# Altium schematic sheet AnalogSignalConditioning.SchDoc
size A4; CompanyName: Technische Hochschule Nürnberg Georg Simon Ohm; Organization: UltraZohm; Address1: Kesslerplatz 12; Address2: 90489 Nürnberg; Address3: GERMANY; DocumentNumber: 2; SheetNumber: 2; SheetTotal: 2; Website: www.ultrazohm.com
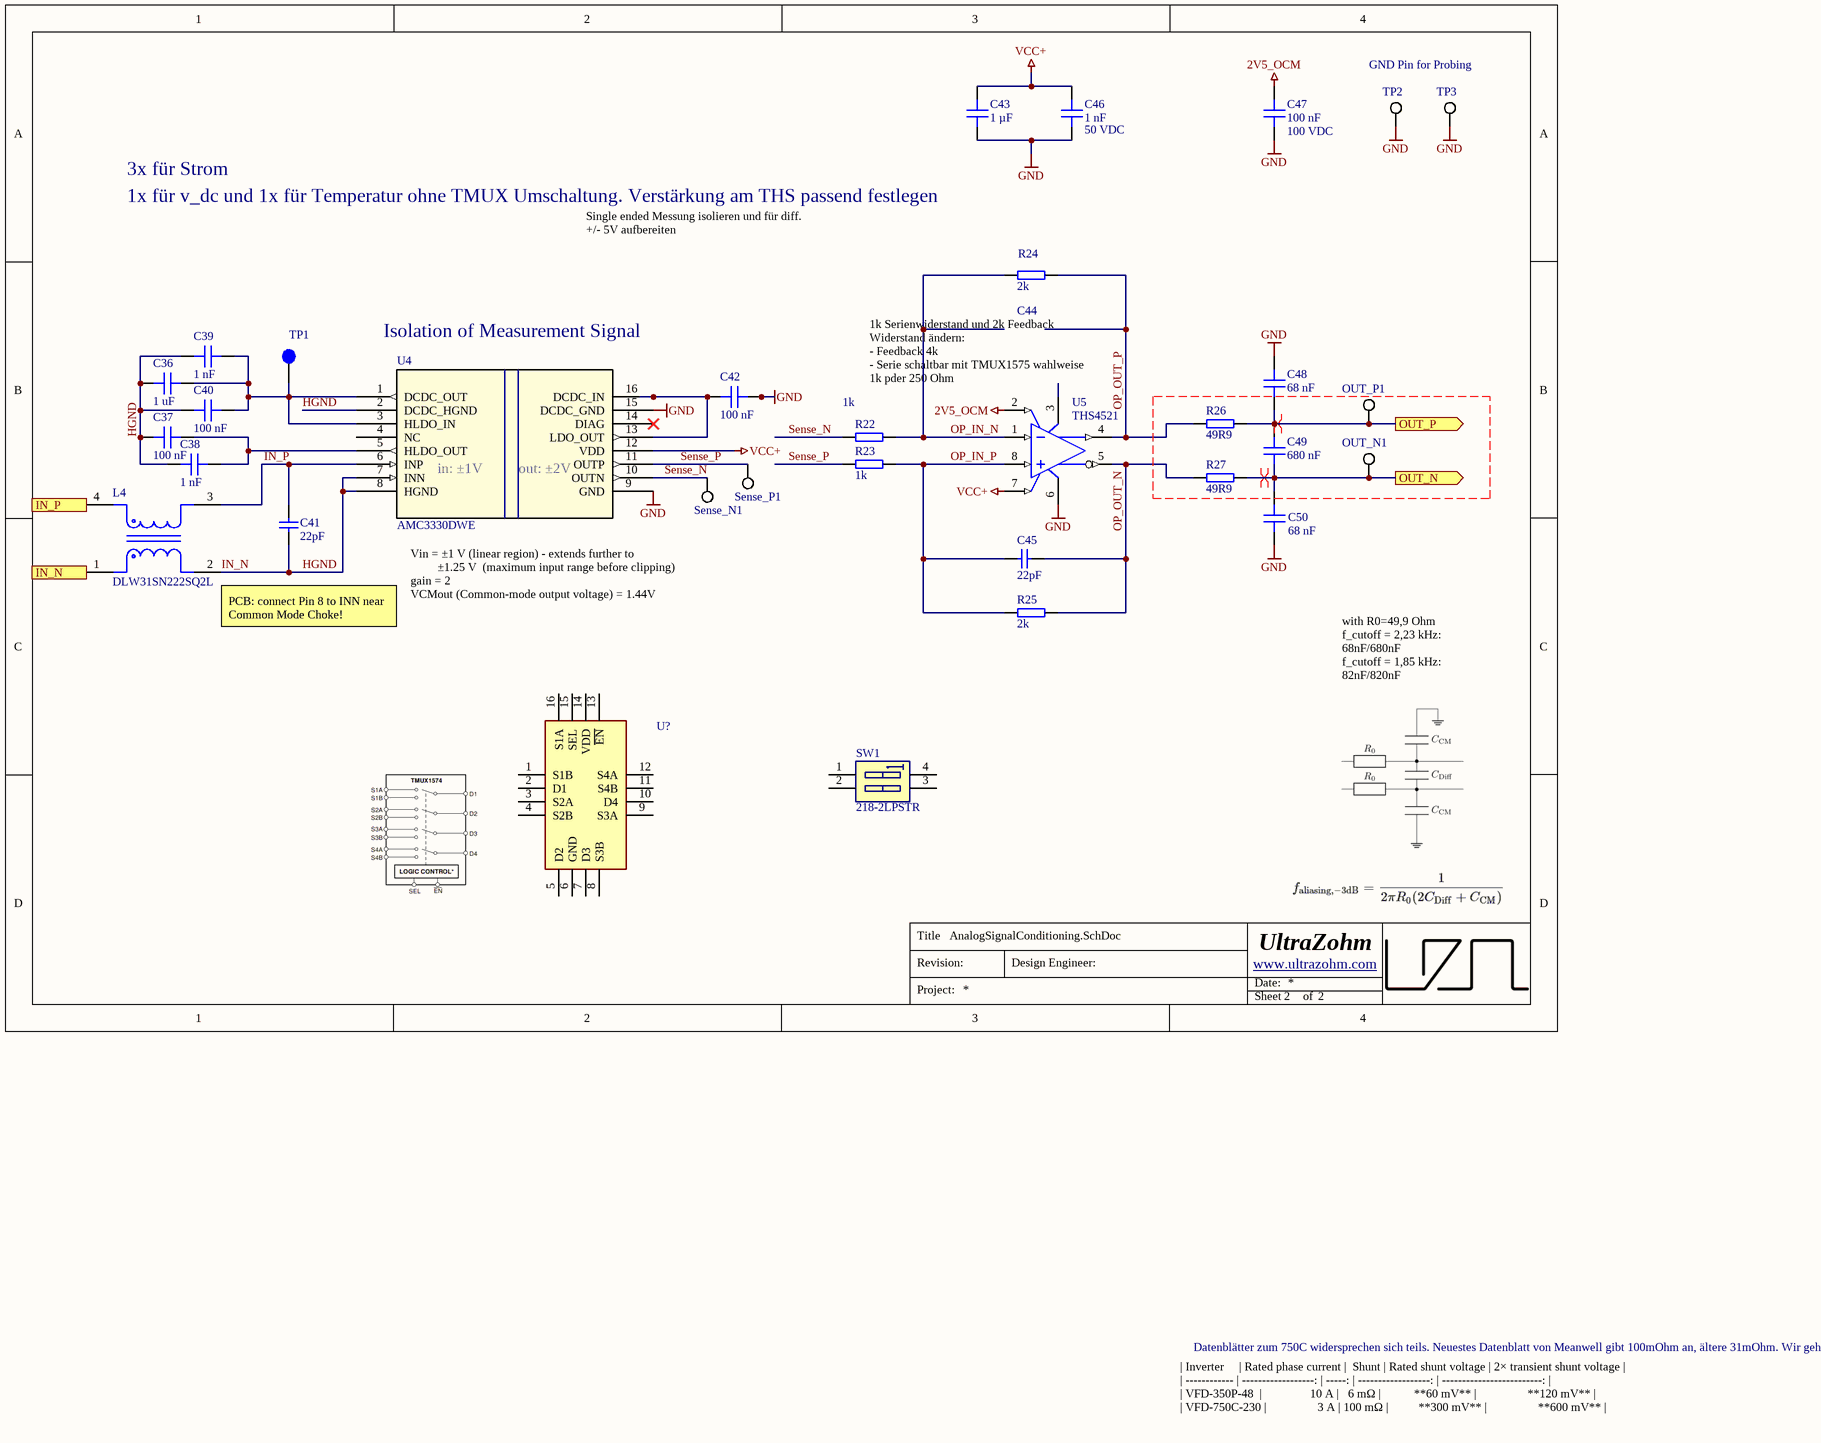
[diagram p0: AnalogSignalConditioning.SchDoc]

## Parts
C36  1 uF  [C_0603]
C37  100 nF  [C_0603]
C38  1 nF  [C_0603_TE]
C39  1 nF  [C_0603_TE]
C40  100 nF  [C_0603]
C41  22pF  [C_0603_TE]
C42  100 nF  [C_0603]
C43  1 µF  [C_0603]
C44  22pF  [C_0603_TE]
C45  22pF  [C_0603_TE]
C46  1 nF  Voltage Rating: 50 VDC  [C_1206_TE]
C47  100 nF  Voltage Rating: 100 VDC  [C_0603]
C48  68 nF  [C_0603_TE]
C49  680 nF  [C_0805_TE]
C50  68 nF  [C_0603_TE]
L4  DLW31SN222SQ2L  [FP-DLW31S-MFG]
OUT_N1  5015  [KSTN-5019_V]  (value not drawn)
OUT_P1  5015  [KSTN-5019_V]  (value not drawn)
R22  1k  [RES 0603_1608]
R23  1k  [RES 0603_1608]
R24  2k  [RES 0603_1608]
R25  2k  [RES 0603_1608]
R26  49R9  [RES 0603_1608]
R27  49R9  [RES 0603_1608]
Sense_N1  5015  [KSTN-5019_V]  (value not drawn)
Sense_P1  5015  [KSTN-5019_V]  (value not drawn)
SW1  218-2LPSTR  [2182LPSTR]
TP1  Testpoint 1mm  [TP_1mm]  (value not drawn)  (no BOM)
TP2  5015  [KSTN-5019_V]  (value not drawn)
TP3  5015  [KSTN-5019_V]  (value not drawn)
U4  AMC3330DWE  [SOIC_30DWER_TEX]
U5  THS4521  [ADA4940-1ARZ-R7]
U?  TMUX1574RSVR  [QFN40P180X260X55-16N]  (value not drawn)

## Ports
IN_N (in), IN_P (in), OUT_N (out), OUT_P (out)

## Nets
2V5_OCM: C47.1 U5.2(VOCM)
GND: C42.2 C43.1 C46.1 C47.2 C48.1 C50.2 TP2.1 TP3.1 U4.9(GND) U4.15(DCDC_GND) U5.6(VS-)
VCC+: C43.2 C46.2 U4.12(VDD) U5.3(VS+) U5.7(~{PD})
HGND: C36.1 C37.1 C38.1 C39.1 C40.1 C41.2 L4.2 U4.2(DCDC_HGND) U4.7(INN) U4.8(HGND)  [also labelled IN_N]
IN_N: L4.1 ; port IN_N
IN_P: C41.1 L4.3 U4.6(INP)
IN_P: L4.4 ; port IN_P  [a separate net that carries the same name]
OP_IN_N: C44.2 R22.2 R24.1 U5.1(VIN-)
OP_IN_P: C45.2 R23.2 R25.1 U5.8(VIN+)
OP_OUT_N: C45.1 R25.2 R27.1 U5.5(VOUT-)
OP_OUT_P: C44.1 R24.2 R26.1 U5.4(VOUT+)
OUT_N: C49.1 C50.1 OUT_N1.1 R27.2 ; port OUT_N
OUT_P: C48.2 C49.2 OUT_P1.1 R26.2 ; port OUT_P
Sense_N: R22.1 Sense_N1.1 U4.10(OUTN)
Sense_P: R23.1 Sense_P1.1 U4.11(OUTP)
NetC36_2: C36.2 C39.2 C40.2 TP1.1 U4.1(DCDC_OUT) U4.3(HLDO_IN)
NetC37_2: C37.2 C38.2 U4.5(HLDO_OUT)
NetC42_1: C42.1 U4.13(LDO_OUT) U4.16(DCDC_IN)

Not connected (* = marked no-connect by the designer): SW1 1 2 3 4; U4 4(NC) 14(DIAG)*; U? 1(S1B) 2(D1) 3(S2A) 4(S2B) 5(D2) 6(GND) 7(D3) 8(S3B) 9(S3A) 10(D4) 11(S4B) 12(S4A) 13(~{EN}) 14(VDD) 15(SEL) 16(S1A)

## Layout directives
differential pair: OUT_N, OUT_P

## Notes on the sheet
- GND Pin for Probing
- 3x für Strom
- 1x für v_dc und 1x für Temperatur ohne TMUX Umschaltung. Verstärkung am THS passend festlegen
- Single ended Messung isolieren und für diff. +/- 5V aufbereiten
- Isolation of Measurement Signal
- (near C44) 1k Serienwiderstand und 2k Feedback Widerstand ändern:
  - Feedback 4k
  - Serie schaltbar mit TMUX1575 wahlweise 1k pder 250 Ohm
- (near U4) in: ±1V
- (near U4) out: ±2V
- (near L4) PCB: connect Pin 8 to INN near Common Mode Choke!
- Vin = ±1 V (linear region) - extends further to
  ±1.25 V  (maximum input range before clipping)
  gain = 2
  VCMout (Common-mode output voltage) = 1.44V
- with R0=49,9 Ohm
  f_cutoff = 2,23 kHz: 68nF/680nF
  f_cutoff = 1,85 kHz: 82nF/820nF
- Datenblätter zum 750C widersprechen sich teils. Neuestes Datenblatt von Meanwell gibt 100mOhm an, ältere 31mOhm. Wir gehen von 100 aus
- | Inverter     | Rated phase current |  Shunt | Rated shunt voltage | 2× transient shunt voltage |
  | ------------ | ------------------: | -----: | ------------------: | -------------------------: |
  | VFD-350P-48  |                10 A |   6 mΩ |           **60 mV** |                 **120 mV** |
  | VFD-750C-230 |                 3 A | 100 mΩ |          **300 mV** |                 **600 mV** |
- Title
- Revision:
- Design Engineer:
- Date:
- Project:
- Sheet
- of

## Library data of the parts
C36 = CC0603KRX5R9BB105: 1uF 50V X5R ±10% 0603 Multilayer Ceramic Capacitors MLCC - SMD/SMT ROHS; Manufacturer: YAGEO; Voltage Rating: 50 VDC; Created from: NDiringer; Manufacturer Part Number: CC0603KRX5R9BB105; PartID: 508; Created On: 25.08.2025 09:26:51; ComponentLink1Description: Datasheet; ComponentLink1URL: https://jlcpcb.com/partdetail/YAGEO-CC0603KRX5R9BB105/C128624; Component Type: Capacitor 0603; Device Package: 0603; Last Updated: 25.08.2025 09:28:02; Mounting Type: SMD; Operating Temperature: -55 to +125°C; Series: X7R; Supplier 1: JLCPCB; Supplier Part Number 1: C128624; Supplier 2: LCSC; Supplier Part Number 2: C15849; Type: Capacitor; Tolerance: 10 %; Value: 1 uF; Live Cycle Status: 1; LCSC Part Number: C15849; Stock number: not stored
C37 C40 C42 = CC0603KRX7R9BB104: Capacitor 0603, 50 VDC, 100 nF, X7R; Manufacturer: YAGEO; Tolerance: 10 %; Created from: AGeiger; Voltage Rating: 50 VDC; Manufacturer Part Number: CC0603KRX7R9BB104; PartID: 102; Created On: 22.08.2022 14:35:53; Value: 100 nF; Device Package: 0603; Mounting Type: SMD; Last Updated: 22.08.2022 14:35:53; ComponentLink1Description: Datasheet; ComponentLink1URL: https://datasheet.lcsc.com/lcsc/1809301912_YAGEO-CC0603KRX7R9BB104_C14663.pdf; Component Type: Capacitor 0603; Operating Temperature: -55 - 125°C; Series: X7R; Supplier 1: LCSC; Supplier Part Number 1: C14663; Supplier 2: Mouser; Supplier Part Number 2: 603-CC603KRX7R9BB104; Type: Capacitor; Live Cycle Status: 1; LCSC Part Number: C14663
C38 C39 = CC0603KRX7R9BB102: 1nF 50V X7R ±10% 0603 Multilayer Ceramic Capacitors MLCC - SMD/SMT ROHS; Manufacturer: YAGEO; Created from: NDiringer; Voltage Rating: 50 VDC; Manufacturer Part Number: CC0603KRX7R9BB102; PartID: 507; Created On: 25.08.2025 09:10:16; Value: 1 nF; Device Package: 0603; Tolerance: 10 %; Mounting Type: SMD; Last Updated: 25.08.2025 09:34:56; ComponentLink1Description: Datasheet; ComponentLink1URL: https://jlcpcb.com/partdetail/YAGEO-CC0603KRX7R9BB102/C100040; Component Type: Capacitor 0603; Operating Temperature: -55 to +125°C; Series: X7R; Supplier 1: JLCPCB; Supplier Part Number 1: C100040; Supplier 2: LCSC; Supplier Part Number 2: C100040; Type: Capacitor; Live Cycle Status: 1; LCSC Part Number: C100040; Stock number: not stored
C41 C44 C45 = CL10C220JB8NNNC: 50V 22pF C0G ±5% 0603 Multilayer Ceramic Capacitors MLCC - SMD/SMT ROHS; Manufacturer: Samsung Electro-Mechanics; Created from: Kilhan; Manufacturer Part Number: CL10C220JB8NNNC; ComponentLink1Description: Datasheet; ComponentLink1URL: https://jlcpcb.com/api/file/downloadByFileSystemAccessId/8579707043277824000; Series: C0G; Supplier 1: LCSC; Supplier Part Number 1: C1653; Tolerance: 5%; Voltage Rating: 50V; PartID: 172; Created On: 22.06.2025 13:02:55; Component Type: Capacitor 0603; Device Package: 0603; Last Updated: 22.06.2025 13:02:55; Mounting Type: SMD; Operating Temperature: –55 to 125°C; Type: Capacitor; Value: 22pF; Live Cycle Status: 1; Stock number: not stored; LCSC Part Number: C1653
C43 = CL10A105KB8NNNC: 50V 1uF X5R ±10% 0603  Multilayer Ceramic Capacitors MLCC - SMD/SMT ROHS; Manufacturer: Samsung Electro-Mechanics; Voltage Rating: 50 VDC; Created from: MGremer; Manufacturer Part Number: CL10A105KB8NNNC; PartID: 5; Created On: 20.12.2020 13:54:13; ComponentLink1Description: Datasheet; ComponentLink1URL: https://datasheet.lcsc.com/lcsc/1810261812_Samsung-Electro-Mechanics-CL10A105KB8NNNC_C15849.pdf; Component Type: Capacitor 0603; Device Package: 0603; Last Updated: 28.11.2022 17:23:01; Mounting Type: SMD; Operating Temperature: -55 - 85°C; Series: M; Supplier 1: LCSC; Supplier Part Number 1: C15849; Type: Capacitor; Tolerance: 10 %; Value: 1 µF; Live Cycle Status: 1; Stock number: Labor SMD Container; LCSC Part Number: C15849
C46 = CC1206KRX7R9BB102: 1nF 50V X7R ±10% 1206 Multilayer Ceramic Capacitors MLCC - SMD/SMT ROHS; Manufacturer: YAGEO; Created from: NDiringer; Manufacturer Part Number: CC1206KRX7R9BB102; PartID: 505; Created On: 25.08.2025 08:45:14; ComponentLink1Description: Datasheet; ComponentLink1URL: https://jlcpcb.com/partdetail/YAGEO-CC1206KRX7R9BB102/C107207; Component Type: Capacitor 1206; Device Package: 1206; Last Updated: 25.08.2025 08:45:14; Mounting Type: SMD; Operating Temperature: -55 to +125°C; Series: X7R; Supplier 1: JLCPCB; Supplier Part Number 1: C107207; Type: Capacitor; Tolerance: 10 %; Value: 1 nF; Live Cycle Status: 1; Stock number: not stored; Supplier 2: LCSC; Supplier Part Number 2: C107207; LCSC Part Number: C107207
C47 = C1608X7S2A104KT000N: 100V 100nF X7S ±10% 0603 Multilayer Ceramic Capacitors MLCC - SMD/SMT ROHS; Manufacturer: TDK; Created from: AGeiger; Manufacturer Part Number: C1608X7S2A104KT000N; PartID: 148; Created On: 20.12.2020 13:54:13; ComponentLink1Description: Datasheet; ComponentLink1URL: https://datasheet.lcsc.com/lcsc/2304140030_TDK-C1608X7S2A104KT000N_C343025.pdf; Component Type: Capacitor 0603; Device Package: 0603; Last Updated: 14.12.2022 12:14:21; Mounting Type: SMD; Operating Temperature: -55 to 125°C; Series: X7R; Supplier 1: LCSC; Supplier Part Number 1: C343025; Type: Capacitor; Tolerance: 10 %; Value: 100 nF; Live Cycle Status: 1; LCSC Part Number: C343025; Stock number: not stored
C48 C50 = CC0603JRX7R9BB683: 50V 68nF X7R ±5% 0603 Multilayer Ceramic Capacitors MLCC - SMD/SMT ROHS; Manufacturer: YAGEO; Voltage Rating: 50 VDC; Created from: NDiringer; Manufacturer Part Number: CC0603JRX7R9BB683; ComponentLink1Description: Datasheet; ComponentLink1URL: https://jlcpcb.com/partdetail/YAGEO-CC0603JRX7R9BB683/C309475; Series: X7R; Supplier 1: JLCPCB; Supplier Part Number 1: C309475; Tolerance: 5 %; PartID: 503; Created On: 14.08.2025 15:37:55; Component Type: Capacitor 0603; Last Updated: 25.08.2025 09:35:07; Mounting Type: SMD; Operating Temperature: -55 to +125°C; Type: Capacitor; Value: 68 nF; Live Cycle Status: 1; Stock number: not stored; LCSC Part Number: C309475; Device Package: 0603
C49 = CC0805KKX7R9BB684: 50V 680nF X7R ±10% 0805 Multilayer Ceramic Capacitors MLCC - SMD/SMT ROHS; Manufacturer: YAGEO; Voltage Rating: 50 VDC; Created from: NDiringer; Manufacturer Part Number: CC0805KKX7R9BB684; ComponentLink1Description: Datasheet; ComponentLink1URL: https://jlcpcb.com/partdetail/YAGEO-CC0805KKX7R9BB684/C107133; Series: X7R; Supplier 1: JLCPCB; Supplier Part Number 1: C107133; Tolerance: 10 %; PartID: 504; Created On: 14.08.2025 15:43:13; Component Type: Capacitor 0805; Device Package: 0805; Last Updated: 14.08.2025 15:43:13; Mounting Type: SMD; Operating Temperature: -55 to +125°C; Type: Capacitor; Value: 680 nF; Live Cycle Status: 1; Stock number: not stored; LCSC Part Number: C107133
L4 = CMP-06045-000034-1: CMC 200MA 2LN 2.2 KOHM SMD; Number of Lines: 2; Voltage Rating: 50V; Voltage Rating (DC): 125V; DC Resistance (DCR): 1.2R; Impedance: 2.2kR; Shielding: Unshielded; Tolerance: 25%; Insulation Resistance: 10MR; Test Frequency: 100MHz; Depth: 1.8mm; DC Current: 200mA; Case/Package: 1206; Number of Pins: 4; Current Rating: 200mA; Weight: 0.001376oz; Current: 200mA; Packaging: Tape and Reel; Termination: SMD/SMT; Height: 1.9mm; Length: 3.2mm; Military Standard: Not; Package Quantity: 1; Mount: Surface Mount; Max Operating Temperature: 85°C; Max DC Current: 200mA; Radiation Hardening: No; Resistor Type: Wirewound; Lead Free: Lead Free; Case Code (Imperial): 1206; Width: 0.063inch; Min Operating Temperature: -40°C; Self Resonant Frequency: 100MHz; REACH SVHC: No SVHC
OUT_N1 OUT_P1 Sense_N1 Sense_P1 TP2 TP3 = 5015: Circuit Board Hardware - PCB SM TEST POINT ON T&R - MINIATURE; Manufacturer: Keystone Electronics; Value: SMD Testpoint; Created from: AGeiger; Supplier Part Number 1: 534-5015; LCSC Part Number: C5199798; Manufacturer Part Number: 5015; PartID: 26; Created On: 03.06.2023 11:19:55; ComponentLink1Description: Datasheet; ComponentLink1URL: https://www.mouser.de/datasheet/2/215/015-744075.pdf; Component Type: Circuit Board Hardware; Device Package: SMD; Last Updated: 03.06.2023 11:43:17; Mounting Type: SMD; Supplier 1: Mouser; Type: PCB SMD Testpoint; Live Cycle Status: 1; ComponentLink2URL: http://www.keyelco.com/product-pdf.cfm?p=1357; ComponentLink2Description: Datasheet
R22 R23 = AR03BTCX1001: 100mW ±0.1% ±25ppm/℃ 1kΩ 0603 Chip Resistor - Surface Mount ROHS; Manufacturer: Viking Tech; Created from: AGeiger; Manufacturer Part Number: AR03BTCX1001; PartID: 240; Created On: 03.09.2022 10:12:43; ComponentLink1Description: Datasheet; ComponentLink1URL: https://datasheet.lcsc.com/lcsc/2011191435_Viking-Tech-AR03BTCX1001_C304069.pdf; Component Type: SMD resistor; Device Package: 0603; Last Updated: 03.09.2022 10:12:43; Mounting Type: SMD; Supplier 1: LCSC; Supplier Part Number 1: C304069; Type: Resistor; Value: 1k; Live Cycle Status: 1; LCSC Part Number: C304069; Tolerance: 0.1%
R24 R25 = ERJ-PB3B2001V: SMD resistor 0.1%; Manufacturer: Panasonic; Created from: DHufnagel; Manufacturer Part Number: ERJ-PB3B2001V; PartID: 215; Created On: 14.12.2020 16:17:14; ComponentLink1Description: Datasheet; ComponentLink1URL: https://www.mouser.de/datasheet/2/315/AOA0000C328-1530132.pdf; Component Type: SMD resistor; Device Package: 0603; Last Updated: 02.03.2021 14:07:32; Mounting Type: SMD; Supplier 1: Mouser; Supplier Part Number 1: 667-ERJ-PB3B2001V; Type: Resistor; Value: 2k; Live Cycle Status: 1; Stock number: not stored; LCSC Part Number: C728588; Tolerance: 0.1%; Supplier 2: LCSC; Supplier Part Number 2: C728588
R26 R27 = RC0603FR-0749R9L: 100mW Thick Film Resistors ±100ppm/℃ ±1% 49.9Ω 0603 Chip Resistor - Surface Mount ROHS; Manufacturer: YAGEO; Created from: AGeiger; Manufacturer Part Number: RC0603FR-0749R9L; PartID: 277; Created On: 14.06.2023 17:42:26; ComponentLink1Description: Datasheet; ComponentLink1URL: https://datasheet.lcsc.com/lcsc/2304140030_YAGEO-RC0603FR-0749R9L_C114625.pdf; Component Type: SMD resistor; Device Package: 0603; Last Updated: 14.06.2023 17:42:26; Mounting Type: SMD; Supplier 1: LCSC; Supplier Part Number 1: C114625; Type: Resistor; Tolerance: 1%; Value: 49R9; Live Cycle Status: 1; LCSC Part Number: C114625
SW1 = 218-2LPSTR: DIP Switches/SIP Switches SPST 2 switch sections; Manufacturer: CTS Electronic Components; Created from: AGeiger; Manufacturer Part Number: 218-2LPSTR; PartID: 44; Created On: 23.08.2024 11:42:29; ComponentLink1Description: Datasheet; ComponentLink1URL: https://www.mouser.de/datasheet/2/96/CTS_Switches_DIP_218_Series_Datasheet-1144897.pdf; Component Type: DIP Switch; Device Package: SMD-4P,3.7x5.8mm; Last Updated: 23.08.2024 11:42:29; Mounting Type: SMD; Operating Temperature: -55 to +85 °C; Supplier 1: Mouser; Supplier Part Number 1: 774-2182LPSTR; Supplier 2: LCSC; Supplier Part Number 2: C2961921; Type: Dip Switch 2p; Value: 218-2LPSTR; Live Cycle Status: 1; LCSC Part Number: C2961921
TP1 = NULL: Manufacturer Part Number: NULL; Created from: AGeiger; Created: 2018_06_25_AGeiger; Value: Testpoint 1mm; PartID: 9; Created On: 20.09.2022 13:14:57; Component Type: Testpoint; Last Updated: 20.09.2022 13:15:39; Manufacturer: NULL; Supplier 1: NULL; Supplier Part Number 1: NULL; Type: Testpoint; Live Cycle Status: 1
U4 = AMC3330DWE: ±1-V input, precision voltage sensing reinforced isolated amplifier with integrated DC/DC; Manufacturer: Texas Instruments; Channels: 1; Created from: NDiringer; Manufacturer Part Number: AMC3330DWE; PartID: 41; Created On: 20.08.2025 13:08:03; ComponentLink1Description: Datasheet; ComponentLink1URL: https://www.ti.com/product/AMC3330; Component Type: Differential Amplifier; Device Package: SOIC-16; Last Updated: 20.08.2025 13:08:03; Mounting Type: SMD; Operating Temperature: -40 to +125 °C; Series: AMC3330; Supplier 1: LCSC; Supplier Part Number 1: C2999368; Type: Differential Amplifiers; Live Cycle Status: 1; LCSC Part Number: C2999368; Stock number: not stored
U5 = THS4521IDGKR: 145MHz 240uV 700nA Single Channel 95MHz SOIC-8 Differential Amplifiers ROHS; Manufacturer: Texas Instruments; Manufacturer Part Number: THS4521IDR; Min Dual Supply Voltage: 1.5V; Max Dual Supply Voltage: 2.75V; Number of Channels: 1; Voltage Gain: 119dB; Slew Rate: 490V/µs; Max I/O Voltage: 2mV; Max Supply Voltage: 5.5V; Min Supply Voltage: 2.5V; Common Mode Rejection Ratio: 80dB; Operating Supply Voltage: 5V; Nominal Supply Current: 1.14mA; Input Bias Current: 900nA; Output Current per Channel: 55mA; Supplier 1: Mouser; RoHS: Yes; Category: Amplifiers - Op Amps, Buffer, Instrumentation; Stock 1: 12114; Pricing 1: 1=2,55000, 10=2,29000, 25=2,16000, 100=1,78000, 250=1,59000, 500=1,54000, 1000=1,28000, 2500=1,25000, 1=2,83000, 10=2,54000, 25=2,40000, 100=1,98000, 250=1,77000, 500=1,71000 (EUR); Case/Package: SOIC8; Number of Pins: 8; Weight: 0.000935oz; Min Operating Temperature: -40°C; Max Operating Temperature: 85°C; Packaging: Tape and Reel; Unity Gain Bandwidth Product: 95MHz; Bandwidth: 145MHz; Package Quantity: 2500; -3db Bandwidth: 145MHz; Gain Bandwidth Product: 95MHz; Input Offset Voltage (Vos): 2mV; Operating Supply Current: 1.14mA; Power Supply Rejection Ratio (PSRR): 80dB; Number of Circuits: 1; Number of Elements: 1; Number of Amplifiers: 1; Radiation Hardening: No; Lead Free: Lead Free; REACH SVHC: No SVHC; ComponentLink1URL: https://datasheet.ciiva.com/14456/sbos458f-14456592.pdf?src-supplier=Avnet; ComponentLink1Description: old Datasheet; ComponentLink2URL: https://datasheet.ciiva.com/18622/ths4521-18622155.pdf?src-supplier=Digi-Key; ComponentLink2Description: Datasheet; Supplier Part Number 1: 595-THS4521IDR; ComponentLink3Description: Manufacturer; ComponentLink3URL: https://www.ti.com/; LCSC Part Number: C16092
U? = TMUX1574RSVR: Analog Switches - 4 Channel; Manufacturer: Texas Instruments; Created from: FRosner; Manufacturer Part Number: TMUX1574RSVR; PartID: 12; Created On: 01.06.2026 08:48:39; ComponentLink1Description: Datasheet; ComponentLink1URL: https://www.ti.com/cn/lit/ds/symlink/tmux1574.pdf?ts=1780283446837; Component Type: Analog Switch; Device Package: UQFN-16; Last Updated: 01.06.2026 08:48:39; Mounting Type: SMD; Operating Temperature: -40 to +125 °C; Series: TMUX1574; Supplier 1: LCSC; Supplier Part Number 1: C2673120; Value: TMUX1574RSVR; LCSC Part Number: C2673120